# Altium schematic sheet User_Control_IO.SchDoc: =SheetTitle
size A4; SheetTitle: User Control Buttons IO; DrawnBy: Samyar Sadat Akhavi; SheetNumber: 18; SheetTotal: 19
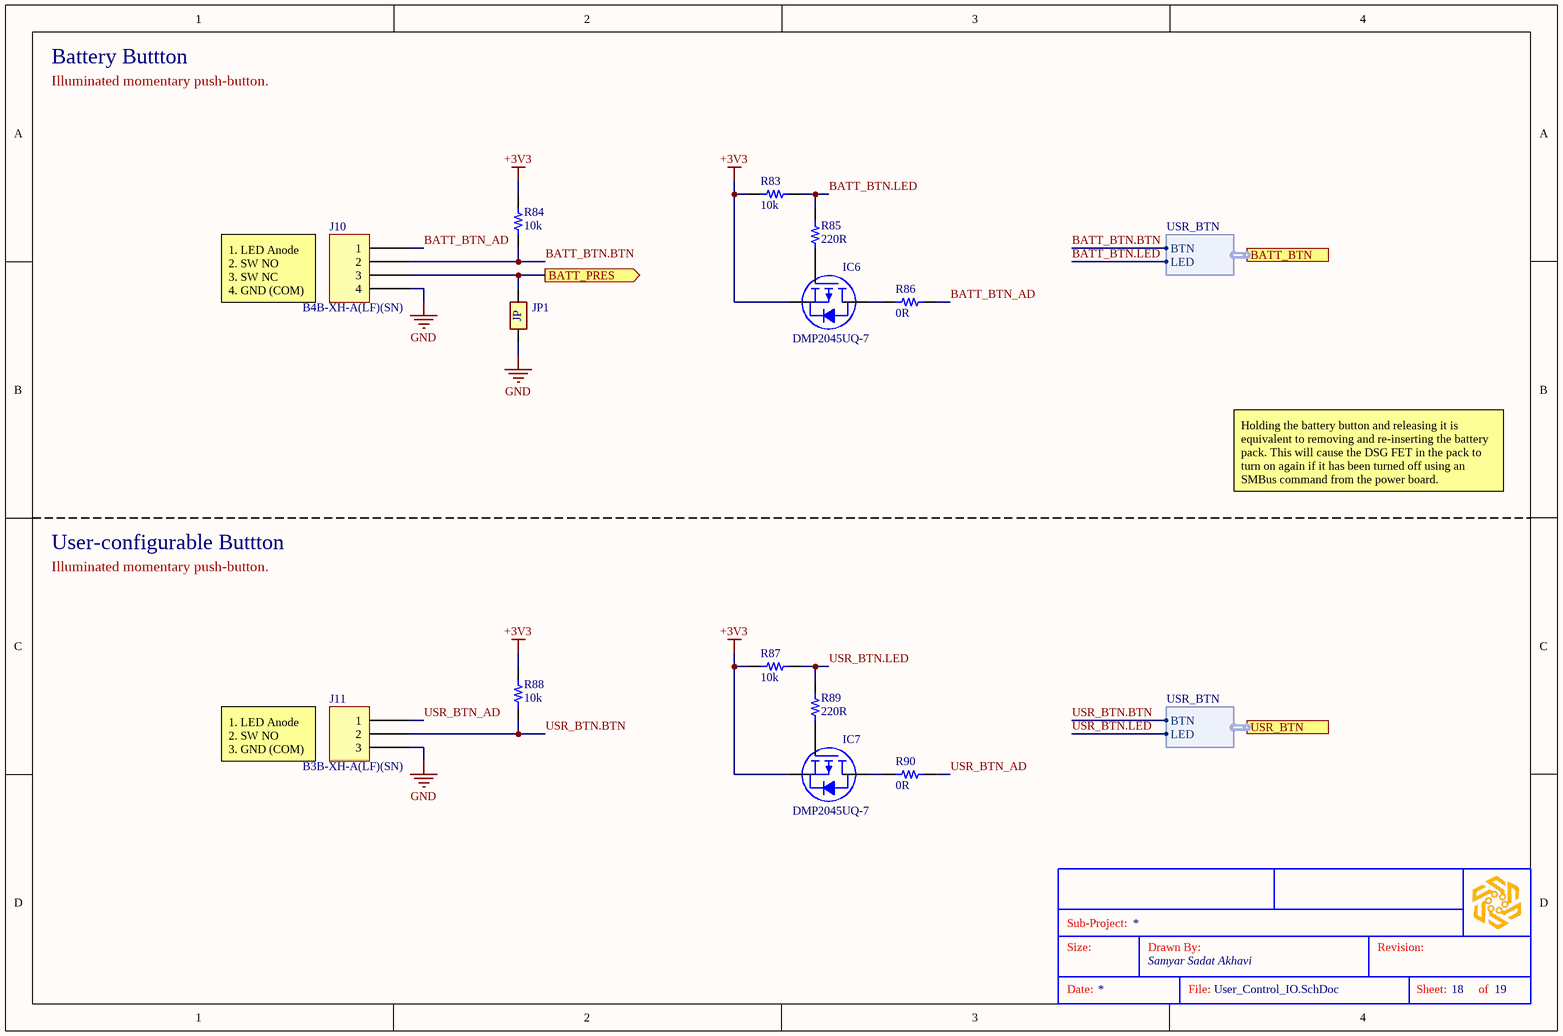
[diagram p0: User_Control_IO.SchDoc]

## Parts
?  (no value)  (graphical)
IC6  DMP2045UQ-7  [DIODES SOT-23-3]
IC7  DMP2045UQ-7  [DIODES SOT-23-3]
J10  B4B-XH-A(LF)(SN)  [JST XH B4B-XH-A]
J11  B3B-XH-A(LF)(SN)  [JST XH B3B-XH-A]
JP1  Jumper Pad  [Jumper_Pad]  (value not drawn)  (no BOM)
R83  10k  [RES 0603_1608]
R84  10k  [RES 0603_1608]
R85  220R  [RES 0603_1608]
R86  0R  [RES 0603_1608]
R87  10k  [RES 0603_1608]
R88  10k  [RES 0603_1608]
R89  220R  [RES 0603_1608]
R90  0R  [RES 0603_1608]

## Ports
BATT_BTN (harness USR_BTN, see Power_Board[2B], Microcontroller[4A]), BATT_PRES (out, see Power_Board[1B], Battery_Input[3A]), USR_BTN (harness USR_BTN, see Power_Board[2B], Microcontroller[4A])

## Harnesses
USR_BTN: LED, BTN
USR_BTN: BTN, LED

## Nets
+3V3: IC6.2(S) IC7.2(S) R83.1 R84.2 R87.1 R88.2
GND: J10.4 J11.3 JP1.1
BATT_BTN.BTN: J10.2 R84.1 ; port BATT_BTN.BTN
BATT_BTN.LED: R83.2 R85.2 ; port BATT_BTN.LED
BATT_BTN_AD: J10.1 R86.2
BATT_PRES: J10.3 JP1.2 ; port BATT_PRES
USR_BTN.BTN: J11.2 R88.1 ; port USR_BTN.BTN
USR_BTN.LED: R87.2 R89.2 ; port USR_BTN.LED
USR_BTN_AD: J11.1 R90.2
NetIC6_1: IC6.1(G) R85.1
NetIC6_3: IC6.3(D) R86.1
NetIC7_1: IC7.1(G) R89.1
NetIC7_3: IC7.3(D) R90.1

## Notes on the sheet
- Battery Buttton
- Illuminated momentary push-button.
- 1. LED Anode
  2. SW NO
  3. SW NC
  4. GND (COM)
- Holding the battery button and releasing it is equivalent to removing and re-inserting the battery pack. This will cause the DSG FET in the pack to turn on again if it has been turned off using an SMBus command from the power board.
- User-configurable Buttton
- 1. LED Anode
  2. SW NO
  3. GND (COM)
- Sub-Project:
- Size:
- Drawn By:
- Revision:
- Date:
- File:
- Sheet:
- of
- (in symbol GEN-PCBSJPS2) JP

## Library data of the parts
? = SGR-STDTBSA4: STANDARD SCHEMATICS TITLE BLOCK
IC6 IC7 = DMP2045UQ-7: MOSFET P-CH 20V 4.3A SOT23; Manufacturer: Diodes Incorporated; Current - Continuous Drain (Id) @ 25°C: 4.3A (Ta); Drive Voltage (Max Rds On,  Min Rds On): 1.8V, 4.5V; FET Type: P-Channel; Gate Charge (Qg) (Max) @ Vgs: 6.8 nC @ 4.5 V; Input Capacitance (Ciss) (Max) @ Vds: 634 pF @ 10 V; Power Dissipation (Max): 800mW (Ta); Rds On (Max) @ Id, Vgs: 45mOhm @ 4A, 4.5V; Vgs (Max): ±8V; Vgs(th) (Max) @ Id: 1V @ 250µA; Part Number: DMP2045UQ-7; ComponentLink1Description: Datasheet; ComponentLink1URL: https://www.diodes.com/assets/Datasheets/DMP2045UQ.pdf; ComponentLink2Description: DigiKey Link; ComponentLink2URL: https://www.digikey.com/en/products/detail/diodes-incorporated/DMP2045UQ-7/10674156; Drain to Source Voltage (Vdss): 20 V; LastUpdated: 6/3/2024 8:15:19 PM; Lifecycle Status: Active; Minimum Order: 1; Mounting Type: Surface Mount; Operating Temperature: -55°C ~ 150°C (TJ); Package / Case: TO-236-3, SC-59, SOT-23-3; Packaging: TapeAndReel; Part Status: Active; Price: 0.08; Series: -; Supplier 1: DigiKey; Supplier Part Number 1: 31-DMP2045UQ-7CT-ND; Supplier Device Package: SOT-23-3; Technology: MOSFET (Metal Oxide)
J10 = B4B-XH-A(LF)(SN): CONN HEADER VERT 4POS 2.5MM; Manufacturer: JST Sales America Inc.; Contact Length - Post: 0.134" (3.40mm); Current Rating (Amps): 3A; Material Flammability Rating: UL94 V-0; Number of Positions: 4; Number of Positions Loaded: All; Pitch - Mating: 0.098" (2.50mm); Shrouding: Shrouded - 4 Wall; Style: Board to Cable/Wire; Voltage Rating: 250V; Part Number: B4B-XH-A(LF)(SN); ComponentLink1Description: Datasheet; ComponentLink1URL: http://www.jst-mfg.com/product/pdf/eng/eXH.pdf; ComponentLink2Description: DigiKey Link; ComponentLink2URL: http://digikey.com/product-detail/en/jst-sales-america-inc/B4B-XH-A-LF-SN/455-2249-ND/1651047; Connector Type: Header; Contact Finish - Mating: Tin; Contact Finish - Post: Tin; Contact Material: Brass; Contact Shape: Square; Contact Type: Male Pin; Fastening Type: Detent Lock; Insulation Color: Natural; Insulation Height: 0.276" (7.00mm); Insulation Material: Polyamide (PA66), Nylon 6/6; LastUpdated: 1/12/2020 11:46:34 PM; Lifecycle Status: Active; Minimum Order: 1; Mounting Type: Through Hole; Number of Rows: 1; Operating Temperature: -25°C ~ 85°C; Packaging: Bulk; PartId: 69; Part Status: Active; Price: 0.21; Series: XH; Supplier 1: DigiKey; Supplier Part Number 1: 455-2249-ND; Termination: Press-Fit, Solder
J11 = B3B-XH-A(LF)(SN): CONN HEADER VERT 3POS 2.5MM; Manufacturer: JST Sales America Inc.; Contact Length - Post: 0.134" (3.40mm); Current Rating (Amps): 3A; Material Flammability Rating: UL94 V-0; Number of Positions: 3; Number of Positions Loaded: All; Pitch - Mating: 0.098" (2.50mm); Shrouding: Shrouded - 4 Wall; Style: Board to Cable/Wire; Voltage Rating: 250V; Part Number: B3B-XH-A(LF)(SN); ComponentLink1Description: Datasheet; ComponentLink1URL: http://www.jst-mfg.com/product/pdf/eng/eXH.pdf; ComponentLink2Description: DigiKey Link; ComponentLink2URL: http://digikey.com/product-detail/en/jst-sales-america-inc/B3B-XH-A-LF-SN/455-2248-ND/1651046; Connector Type: Header; Contact Finish - Mating: Tin; Contact Finish - Post: Tin; Contact Material: Brass; Contact Shape: Square; Contact Type: Male Pin; Fastening Type: Detent Lock; Insulation Color: Natural; Insulation Height: 0.276" (7.00mm); Insulation Material: Polyamide (PA66), Nylon 6/6; LastUpdated: 1/12/2020 11:46:22 PM; Lifecycle Status: Active; Minimum Order: 1; Mounting Type: Through Hole; Number of Rows: 1; Operating Temperature: -25°C ~ 85°C; Packaging: Bulk; PartId: 68; Part Status: Active; Price: 0.19; Series: XH; Supplier 1: DigiKey; Supplier Part Number 1: 455-2248-ND; Termination: Press-Fit, Solder
JP1 = GEN-PCBSJPS2: CIRCULAR, SOLDERABLE JUMPER SELECTOR PAD; Part Number: GEN-PCBSJPS2; Size Variant: 2mm
R83 R84 R87 R88 = GEN-CRR10KT1P8603: GENERIC 0603 CHIP RESISTOR; Tolerance: ±1%; Power: 0.125W; Part Number: GEN-CRR10KT1P8603; Value: 10k
R85 R89 = GEN-CRR220T5P8603: GENERIC 0603 CHIP RESISTOR; Tolerance: ±5%; Power: 0.125W; Part Number: GEN-CRR220T5P8603; Value: 220R
R86 R90 = GEN-CRR0603: GENERIC 0603 CHIP RESISTOR (JUMPER); Part Number: GEN-CRR0603; Value: 0R